# Altium schematic sheet Sheet1.SchDoc
size A
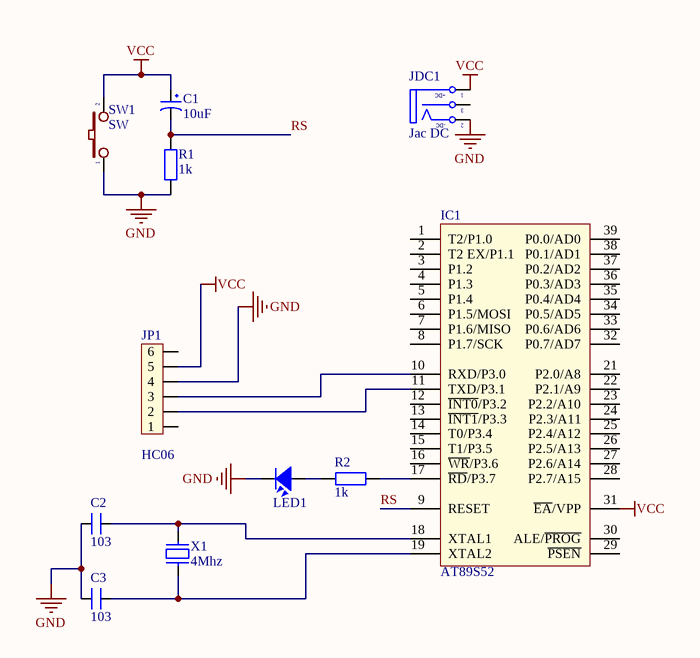
[diagram p0: Sheet1.SchDoc]

## Parts
C1  10uF  [CP1/2]
C2  103  [CN1.5]
C3  103  [CN1.5]
IC1  AT89S52  [DIP40/W0.6]
JDC1  Jac DC  [DC-IN]
JP1  HC06  [JP6]
LED1  LED  [LED-3]  (value not drawn)
R1  1k  [R1/4W]
R2  1k  [R1/4W]
SW1  SW  [SW2]
X1  4Mhz  [XT2]

## Nets
GND: C2.1 C3.1 IC1.20(GND) JDC1.2(TN) JP1.4 LED1.2 R1.1 SW1.1
VCC: C1.1 IC1.31(~{EA}/VPP) IC1.40(VCC) JDC1.1(T) JP1.5 SW1.2
RS: C1.2 IC1.9(RESET) R1.2
NetC2_2: C2.2 IC1.18(XTAL1) X1.1
NetC3_2: C3.2 IC1.19(XTAL2) X1.2
NetIC1_10: IC1.10(RXD/P3.0) JP1.3
NetIC1_11: IC1.11(TXD/P3.1) JP1.2
NetIC1_17: IC1.17(~{RD}/P3.7) R2.2
NetLED1_1: LED1.1 R2.1

Not connected (* = marked no-connect by the designer): IC1 1(T2/P1.0) 2(T2_EX/P1.1) 3(P1.2) 4(P1.3) 5(P1.4) 6(P1.5/MOSI) 7(P1.6/MISO) 8(P1.7/SCK) 12(~{INT0}/P3.2) 13(~{INT1}/P3.3) 14(T0/P3.4) 15(T1/P3.5) 16(~{WR}/P3.6) 21(P2.0/A8) 22(P2.1/A9) 23(P2.2/A10) 24(P2.3/A11) 25(P2.4/A12) 26(P2.5/A13) 27(P2.6/A14) 28(P2.7/A15) 29(~{PSEN}) 30(ALE/~{PROG}) 32(P0.7/AD7) 33(P0.6/AD6) 34(P0.5/AD5) 35(P0.4/AD4) 36(P0.3/AD3) 37(P0.2/AD2) 38(P0.1/AD1) 39(P0.0/AD0); JDC1 3(S); JP1 1 6

## Notes on the sheet
- (in symbol DCIN) +DC; -DC

## Library data of the parts
C1 = CP1: Cap P  0,1uF < 22uF , 16 - 50V; Value: 10uF/50V; Description 1: 10 => 220uF/6,3V/10V - 10uF => 100uF/16V; Description 2: 0,1uF => 33uF/50V - 10uF => 22uF/63V; Description 3: 0,47uF => 10uF/100V
C2 C3 = CN1.5: Cap np 682pF => 104pF; Value: 0.01uF
IC1 = AT89S52: AT89S52, 8k Byte Flash Memory , 40 Pin; Value: AT89S52
JDC1 = DCIN: Jac DC input; Value: Jac DC
JP1 = JP6: JP6 PIN; Value: JP7
LED1 = LED: LED Single colour Green and Red; Value: LED 3 ly Single Colour
R1 R2 = R1/4W: Resistor 1/4W; Value: R1/4W - 1K
SW1 = SW2: Switch button 2 pin; Value: SW chip 2 pin
X1 = XT2: Crystal For all Crystal 2pin.; Value: 4Mhz